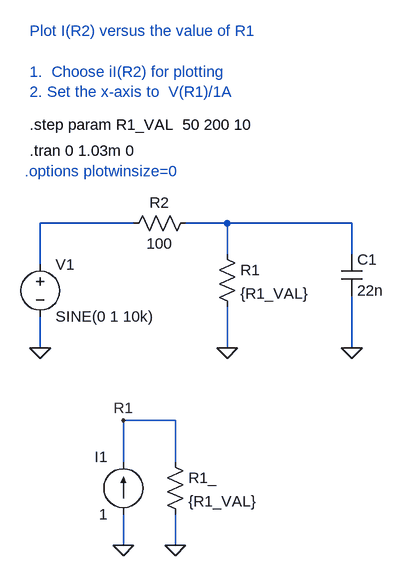
[diagram p0: schematic x_axis_param_tran1.asc]
x_axis_param_tran1.asc, the LTspice schematic file:
Version 4
SHEET 1 880 680
WIRE -112 144 -112 80
WIRE -112 272 -112 224
WIRE 16 448 16 384
WIRE 16 576 16 528
WIRE 32 80 -112 80
WIRE 96 384 16 384
WIRE 96 448 96 384
WIRE 96 576 96 528
WIRE 176 80 112 80
WIRE 176 128 176 80
WIRE 176 272 176 208
WIRE 368 80 176 80
WIRE 368 128 368 80
WIRE 368 272 368 192
FLAG 368 272 0
FLAG 176 272 0
FLAG -112 272 0
FLAG 16 576 0
FLAG 96 576 0
FLAG 16 384 R1
SYMBOL res 160 112 R0
SYMATTR InstName R1
SYMATTR Value {R1_VAL}
SYMBOL res 16 96 R270
WINDOW 0 32 56 VTop 0
WINDOW 3 0 56 VBottom 0
SYMATTR InstName R2
SYMATTR Value 100
SYMBOL cap 352 128 R0
SYMATTR InstName C1
SYMATTR Value 22n
SYMBOL voltage -112 128 R0
WINDOW 123 0 0 Left 0
WINDOW 39 0 0 Left 0
SYMATTR InstName V1
SYMATTR Value SINE(0 1 10k)
SYMBOL res 80 432 R0
SYMATTR InstName R1_
SYMATTR Value {R1_VAL}
SYMBOL current 16 528 R180
WINDOW 0 24 88 Left 0
WINDOW 3 24 0 Left 0
WINDOW 123 0 0 Left 0
WINDOW 39 24 -28 Left 0
SYMATTR InstName I1
SYMATTR Value 1
TEXT -128 -72 Left 0 !.step param R1_VAL  50 200 10
TEXT -128 -32 Left 0 !.tran 0 1.03m 0
TEXT -128 -216 Left 0 ;Plot I(R2) versus the value of R1\n \n1.  Choose iI(R2) for plotting\n2. Set the x-axis to  V(R1)/1A
TEXT -136 0 Left 0 ;.options plotwinsize=0

The netlist it stands for:
* x_axis_param_tran1.asc
R1 N002 0 {R1_VAL}
R2 N001 N002 100
C1 N002 0 22n
V1 N001 0 SINE(0 1 10k)
R1_ R1 0 {R1_VAL}
I1 0 R1 1
.step param R1_VAL  50 200 10
.tran 0 1.03m 0
* Plot I(R2) versus the value of R1
* 1.  Choose iI(R2) for plotting
* 2. Set the x-axis to  V(R1)/1A
* .options plotwinsize=0
.backanno
.end